# EAGLE design input-sequence (EAGLE 7.7.0)
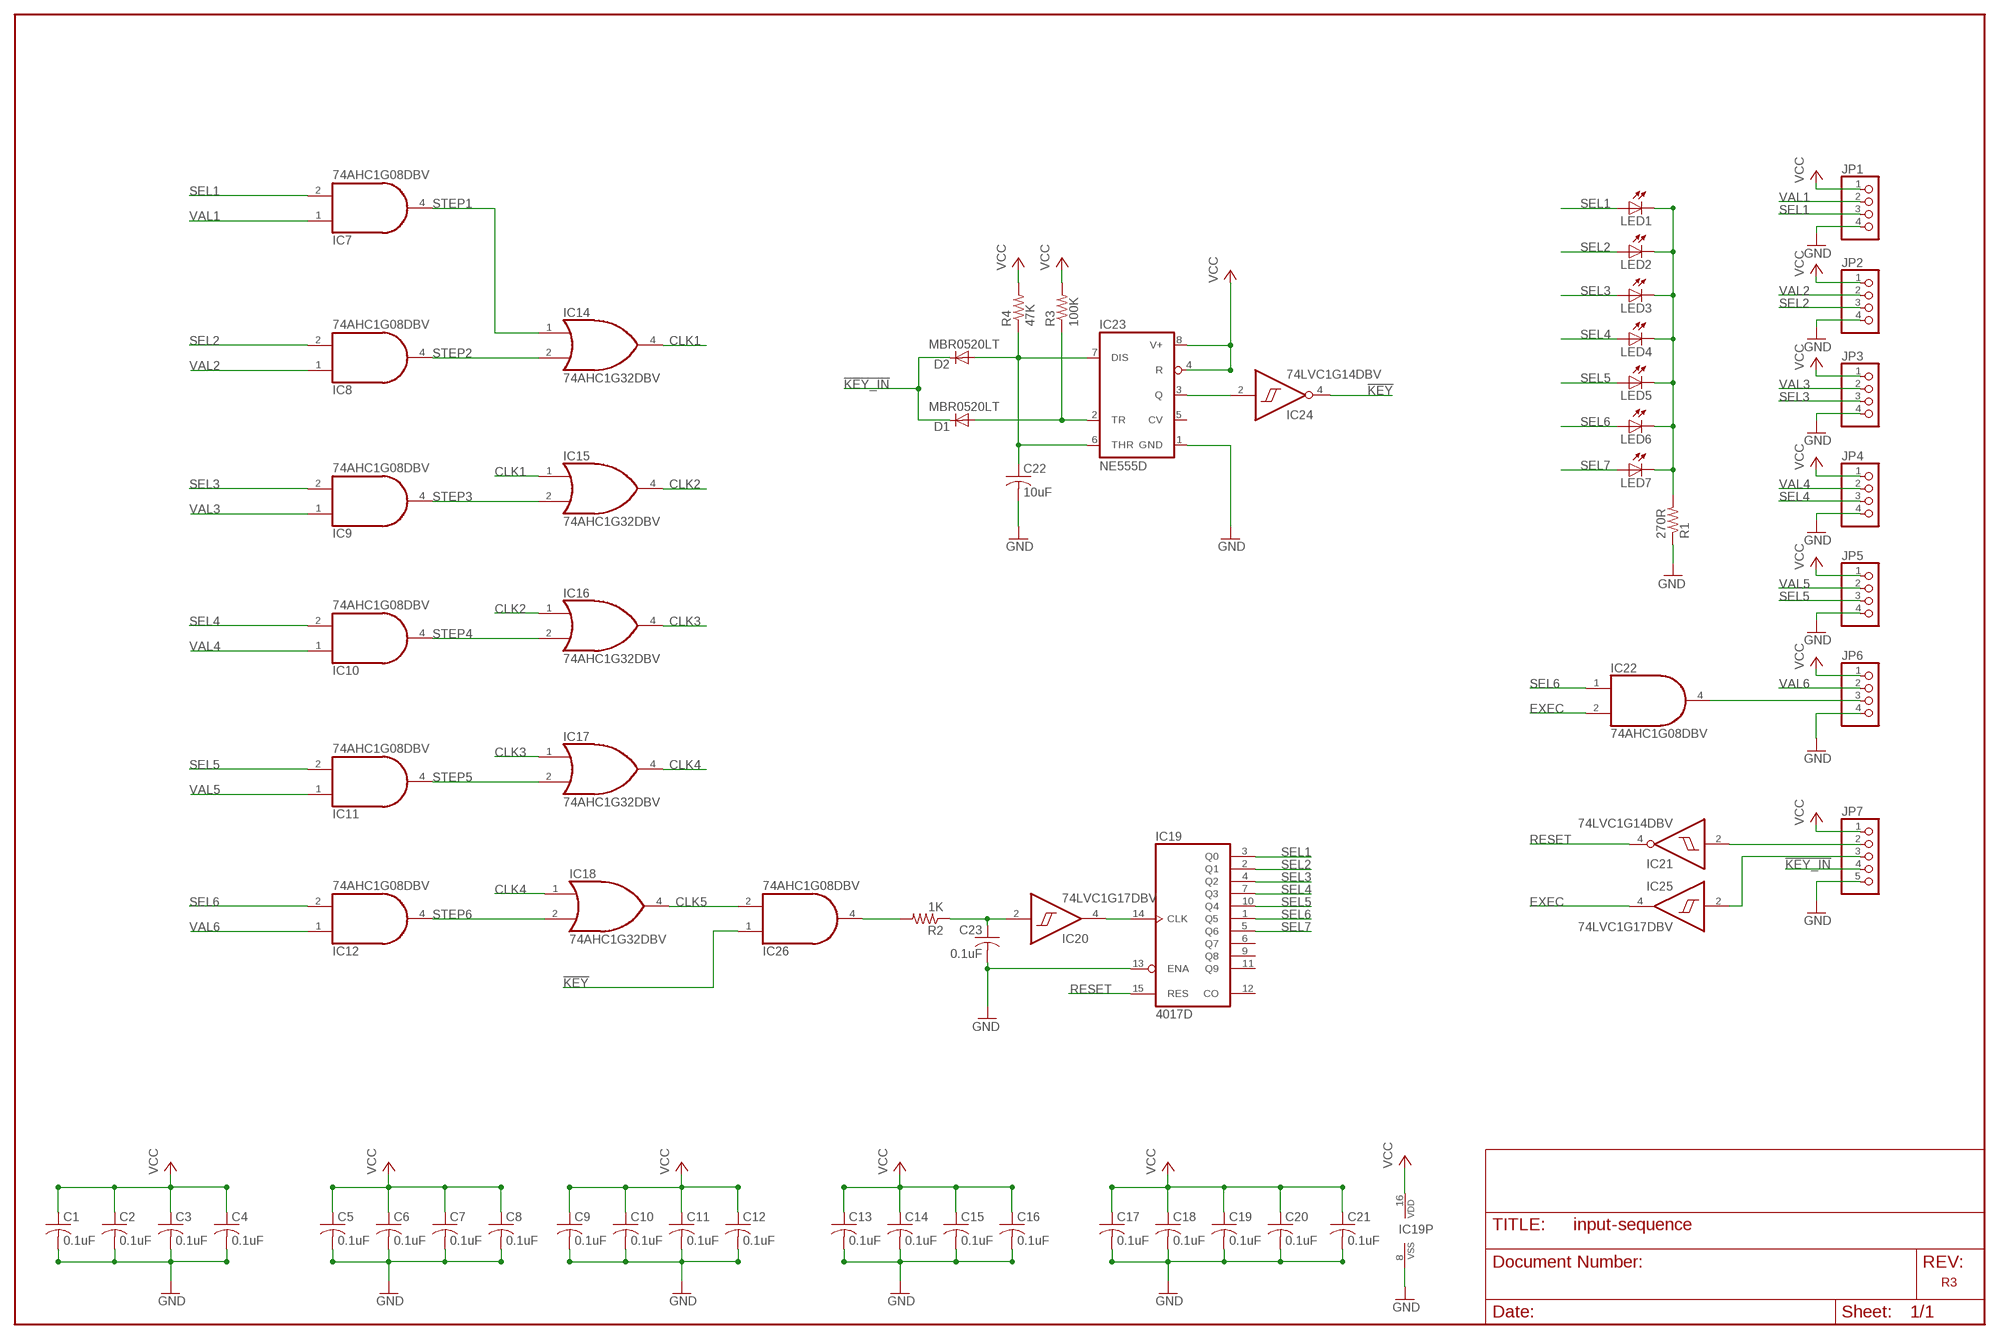
[diagram p0: schematic, sheet 1]

## Parts
C1  0.1uF  C-USC0603  [C0603]
C2  0.1uF  C-USC0603  [C0603]
C3  0.1uF  C-USC0603  [C0603]
C4  0.1uF  C-USC0603  [C0603]
C5  0.1uF  C-USC0603  [C0603]
C6  0.1uF  C-USC0603  [C0603]
C7  0.1uF  C-USC0603  [C0603]
C8  0.1uF  C-USC0603  [C0603]
C9  0.1uF  C-USC0603  [C0603]
C10  0.1uF  C-USC0603  [C0603]
C11  0.1uF  C-USC0603  [C0603]
C12  0.1uF  C-USC0603  [C0603]
C13  0.1uF  C-USC0603  [C0603]
C14  0.1uF  C-USC0603  [C0603]
C15  0.1uF  C-USC0603  [C0603]
C16  0.1uF  C-USC0603  [C0603]
C17  0.1uF  C-USC0603  [C0603]
C18  0.1uF  C-USC0603  [C0603]
C19  0.1uF  C-USC0603  [C0603]
C20  0.1uF  C-USC0603  [C0603]
C21  0.1uF  C-USC0603  [C0603]
C22  10uF  C-USC0805  [C0805]
C23  0.1uF  C-USC0603  [C0603]
D1  MBR0520LT  [SOD123]
D2  MBR0520LT  [SOD123]
IC7  74AHC1G08DBV  [SOT23-5]
IC8  74AHC1G08DBV  [SOT23-5]
IC9  74AHC1G08DBV  [SOT23-5]
IC10  74AHC1G08DBV  [SOT23-5]
IC11  74AHC1G08DBV  [SOT23-5]
IC12  74AHC1G08DBV  [SOT23-5]
IC14  74AHC1G32DBV  [SOT23-5]
IC15  74AHC1G32DBV  [SOT23-5]
IC16  74AHC1G32DBV  [SOT23-5]
IC17  74AHC1G32DBV  [SOT23-5]
IC18  74AHC1G32DBV  [SOT23-5]
IC19  4017D  [SO16]
IC20  74LVC1G17DBV  [SOT23-5]
IC21  74LVC1G14DBV  [SOT23-5]
IC22  74AHC1G08DBV  [SOT23-5]
IC23  NE555D  [SO08]
IC24  74LVC1G14DBV  [SOT23-5]
IC25  74LVC1G17DBV  [SOT23-5]
IC26  74AHC1G08DBV  [SOT23-5]
JP1  PINHD-1X4  [1X04]
JP2  PINHD-1X4  [1X04]
JP3  PINHD-1X4  [1X04]
JP4  PINHD-1X4  [1X04]
JP5  PINHD-1X4  [1X04]
JP6  PINHD-1X4  [1X04]
JP7  PINHD-1X5  [1X05]
LED1  RED  LEDCHIP-LED0805  [CHIP-LED0805]
LED2  RED  LEDCHIP-LED0805  [CHIP-LED0805]
LED3  RED  LEDCHIP-LED0805  [CHIP-LED0805]
LED4  RED  LEDCHIP-LED0805  [CHIP-LED0805]
LED5  RED  LEDCHIP-LED0805  [CHIP-LED0805]
LED6  RED  LEDCHIP-LED0805  [CHIP-LED0805]
LED7  RED  LEDCHIP-LED0805  [CHIP-LED0805]
R1  270R  R-US_R0805  [R0805]
R2  1K  R-US_R0805  [R0805]
R3  100K  R-US_R0805  [R0805]
R4  47K  R-US_R0805  [R0805]

## Nets
!CLEAR: IC21.2(I) JP7.2
!KEY: IC24.4(O) IC26.1(I0)
!KEY_IN: D1.C D2.C JP7.4
CLK1: IC14.4(O) IC15.1(I0)
CLK2: IC15.4(O) IC16.1(I0)
CLK3: IC16.4(O) IC17.1(I0)
CLK4: IC17.4(O) IC18.1(I0)
CLK5: IC18.4(O) IC26.2(I1)
EXEC: IC22.2(I1) IC25.4(O)
GND: C1.2 C2.2 C3.2 C4.2 C5.2 C6.2 C7.2 C8.2 C9.2 C10.2 C11.2 C12.2 C13.2 C14.2 C15.2 C16.2 C17.2 C18.2 C19.2 C20.2 C21.2 C22.2 C23.2 IC19.8(VSS) IC19.13(ENA) IC23.1(GND) JP1.4 JP2.4 JP3.4 JP4.4 JP5.4 JP6.4 JP7.5 R1.1
LED_SINK: LED1.C LED2.C LED3.C LED4.C LED5.C LED6.C LED7.C R1.2
N$7: IC22.4(O) JP6.3
N$8: IC19.14(CLK) IC20.4(O)
N$9: C22.1 D2.A IC23.6(THR) IC23.7(DIS) R4.1
N$10: D1.A IC23.2(TR) R3.1
N$11: IC23.3(Q) IC24.2(I)
N$12: IC25.2(I) JP7.3
N$13: C23.1 IC20.2(I) R2.1
N$14: IC26.4(O) R2.2
RESET: IC19.15(RES) IC21.4(O)
SEL1: IC7.2(I1) IC19.3(Q0) JP1.3 LED1.A
SEL2: IC8.2(I1) IC19.2(Q1) JP2.3 LED2.A
SEL3: IC9.2(I1) IC19.4(Q2) JP3.3 LED3.A
SEL4: IC10.2(I1) IC19.7(Q3) JP4.3 LED4.A
SEL5: IC11.2(I1) IC19.10(Q4) JP5.3 LED5.A
SEL6: IC12.2(I1) IC19.1(Q5) IC22.1(I0) LED6.A
SEL7: IC19.5(Q6) LED7.A
STEP1: IC7.4(O) IC14.1(I0)
STEP2: IC8.4(O) IC14.2(I1)
STEP3: IC9.4(O) IC15.2(I1)
STEP4: IC10.4(O) IC16.2(I1)
STEP5: IC11.4(O) IC17.2(I1)
STEP6: IC12.4(O) IC18.2(I1)
VAL1: IC7.1(I0) JP1.2
VAL2: IC8.1(I0) JP2.2
VAL3: IC9.1(I0) JP3.2
VAL4: IC10.1(I0) JP4.2
VAL5: IC11.1(I0) JP5.2
VAL6: IC12.1(I0) JP6.2
VCC: C1.1 C2.1 C3.1 C4.1 C5.1 C6.1 C7.1 C8.1 C9.1 C10.1 C11.1 C12.1 C13.1 C14.1 C15.1 C16.1 C17.1 C18.1 C19.1 C20.1 C21.1 IC19.16(VDD) IC23.4(R) IC23.8(V+) JP1.1 JP2.1 JP3.1 JP4.1 JP5.1 JP6.1 JP7.1 R3.2 R4.2
Unconnected: IC19.6(Q7) IC19.9(Q8) IC19.11(Q9) IC19.12(CO) IC23.5(CV)

## Notes on the sheet
- R3

## Power pins joined to a net without a drawn wire
GND: IC7.3(GND) IC8.3(GND) IC9.3(GND) IC10.3(GND) IC11.3(GND) IC12.3(GND) IC14.3(GND) IC15.3(GND) IC16.3(GND) IC17.3(GND) IC18.3(GND) IC20.3(GND) IC21.3(GND) IC22.3(GND) IC24.3(GND) IC25.3(GND) IC26.3(GND)
VCC: IC7.5(VCC) IC8.5(VCC) IC9.5(VCC) IC10.5(VCC) IC11.5(VCC) IC12.5(VCC) IC14.5(VCC) IC15.5(VCC) IC16.5(VCC) IC17.5(VCC) IC18.5(VCC) IC20.5(VCC) IC21.5(VCC) IC22.5(VCC) IC24.5(VCC) IC25.5(VCC) IC26.5(VCC)

## Library data of the parts
C1-C23 = resistor:C-US: CAPACITOR, American symbol
D1 D2 = diode:MBR0520LT: SCHOTTKY BARRIER RECTIFIER Source: http://onsemi.com .. MBR0520LT1-D.pdf
IC7-IC12 IC22 IC26 = 74xx-little-us:74*1G08: 2-input AND gate
IC14-IC18 = 74xx-little-us:74*1G32: 2-input OR gate
IC19 = 40xx:4017: COUNTER/DIVIDER
IC20 IC25 = 74xx-little-us:74*1G17: Single Schmitt-Trigger Buffer
IC21 IC24 = 74xx-little-us:74*1G14: Single Schmitt-Trigger Inverter Gate
IC23 = adafruit:*555: TIMER Changed DIP package to have round (not oval) pin pads http://www.ladyada.net/library/pcb/eaglelibrary.html
JP1-JP6 = custom-pinhead:PINHD-1X4: PIN HEADER
JP7 = custom-pinhead:PINHD-1X5: PIN HEADER
LED1-LED7 = led:LED: LED OSRAM: - CHIPLED LG R971, LG N971, LY N971, LG Q971, LY Q971, LO R971, LY R971 LH N974, LH R974 LS Q976, LO Q976, LY Q976 LO Q996 - Hyper CHIPLED LW Q18S LB Q993, LB Q99A, LB R99A - SideLED LS A670, LO A670, LY A670, LG A670, LP A670 LB A673, LV A673, LT A673, LW A673 LH A674 LY A675 LS A676, LA A676, LO A676, LY A676, LW A676 LS A679, LY A679, LG A679 - Hyper Micro SIDELED® LS Y876, LA Y876, LO Y876, LY Y876 LT Y87S - SmartLED LW L88C, LW L88S LB L89C, LB L89S, LG L890 LS L89K, LO L89K, LY L89K LS L896, LA L896, LO L896, LY L896 - TOPLED LS T670, LO T670, LY T670, LG T670, LP T670 LSG T670, LSP T670, LSY T670, LOP T670, LYG T670 LG T671, LOG T671, LSG T671 LB T673, LV T673, LT T673, LW T673 LH T674 LS T676, LA T676, LO T676, LY T676, LB T676, LH T676, LSB T676, LW T676 LB T67C, LV T67C, LT T67C, LS T67K, LO T67K, LY T67K, LW E67C LS E67B, LA E67B, LO E67B, LY E67B, LB E67C, LV E67C, LT E67C LW T67C LS T679, LY T679, LG T679 LS T770, LO T770, LY T770, LG T770, LP T770 LB T773, LV T773, LT T773, LW T773 LH T774 LS E675, LA E675, LY E675, LS T675 LS T776, LA T776, LO T776, LY T776, LB T776 LHGB T686 LT T68C, LB T68C - Hyper Mini TOPLED® LB M676 - Mini TOPLED Santana® LG M470 LS M47K, LO M47K, LY M47K Source: http://www.osram.convergy.de LUXEON: - LUMILED® LXK2-PW12-R00, LXK2-PW12-S00, LXK2-PW14-U00, LXK2-PW14-V00 LXK2-PM12-R00, LXK2-PM12-S00, LXK2-PM14-U00 LXK2-PE12-Q00, LXK2-PE12-R00, LXK2-PE12-S00, LXK2-PE14-T00, LXK2-PE14-U00 LXK2-PB12-K00, LXK2-PB12-L00, LXK2-PB12-M00, LXK2-PB14-N00, LXK2-PB14-P00, LXK2-PB14-Q00 LXK2-PR12-L00, LXK2-PR12-M00, LXK2-PR14-Q00, LXK2-PR14-R00 LXK2-PD12-Q00, LXK2-PD12-R00, LXK2-PD12-S00 LXK2-PH12-R00, LXK2-PH12-S00 LXK2-PL12-P00, LXK2-PL12-Q00, LXK2-PL12-R00 Source: www.luxeon.com KINGBRIGHT: KA-3528ASYC Source: www.kingbright.com
R1-R4 = resistor:R-US_: RESISTOR, American symbol

## Board
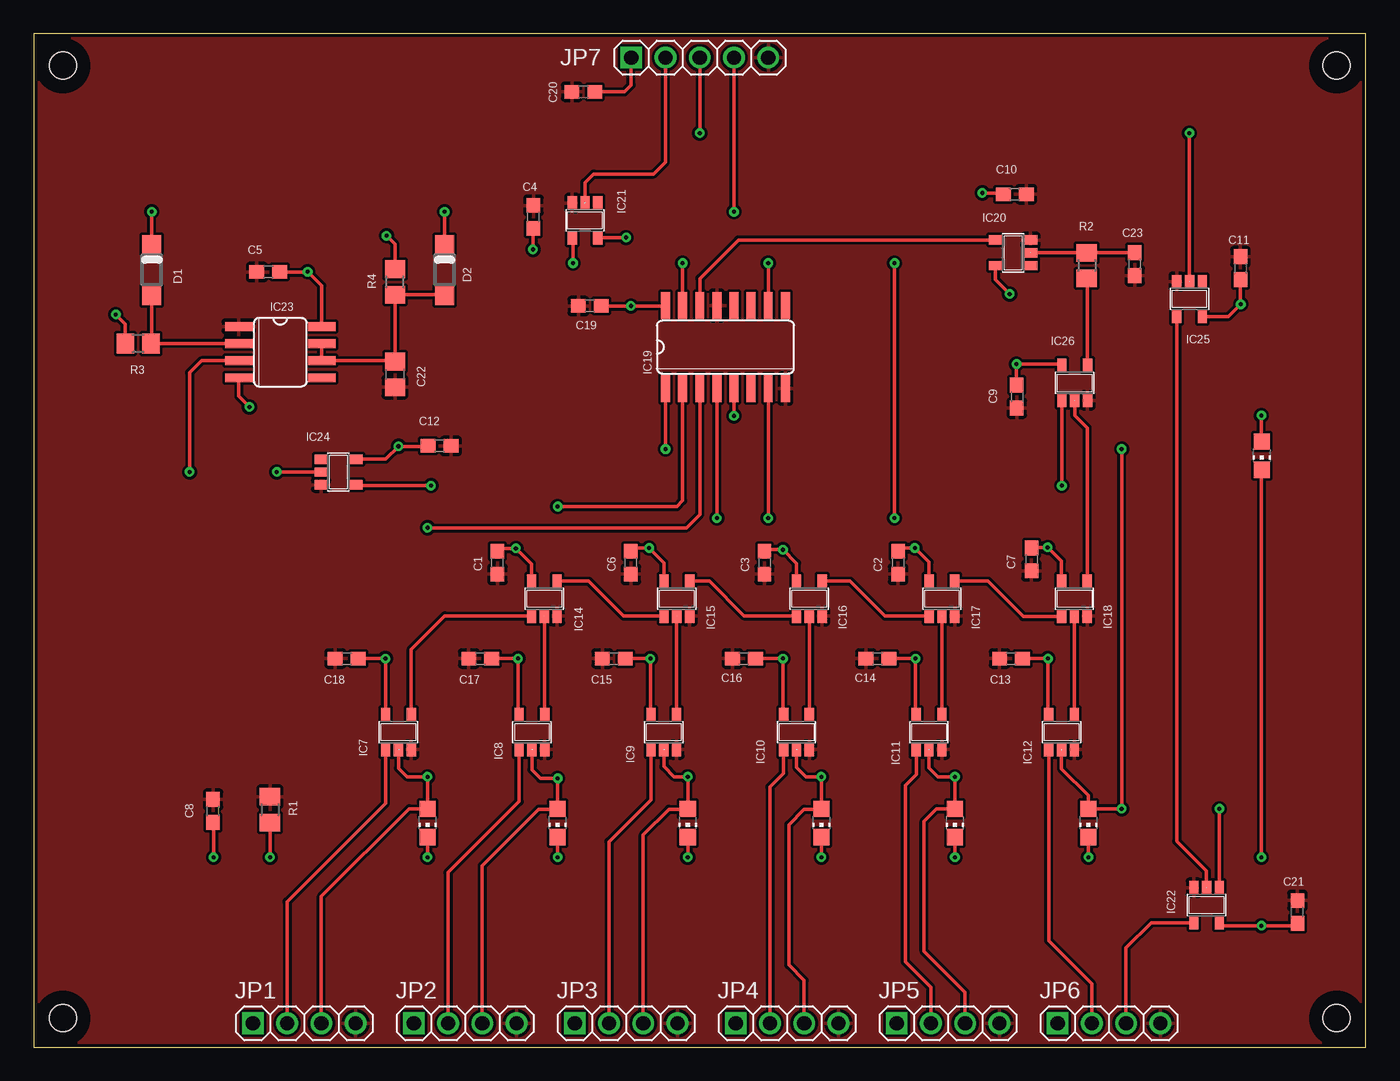
[diagram p1: board, top side]
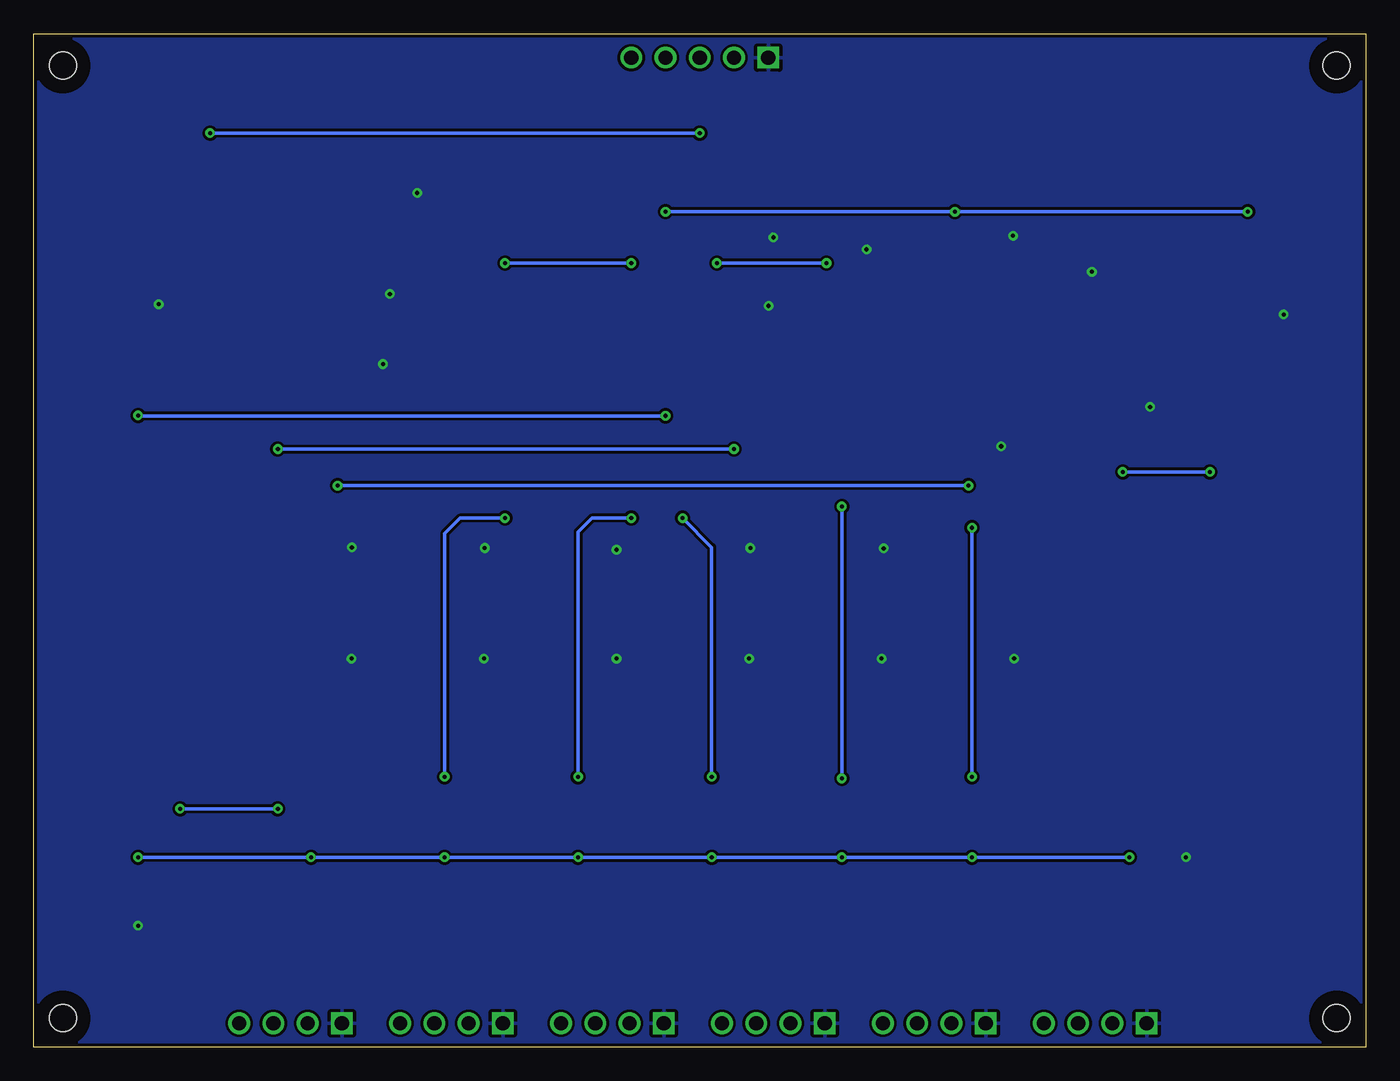
[diagram p2: board, bottom side, seen from below]

Size 98.81 x 75.18 mm. Coordinates in mm from the lower left corner, seen from the top.
Outline: 0,0 98.81,0 98.81,75.18 0,75.18 0,0
Copper layers (1*16): Top 0.035mm / dielectric 1.5mm / Bottom 0.035mm
Design rules "default *": minimum track width 10mil, minimum drill 12mil, track to track 8mil, track to pad 8mil, pad to pad 8mil, via to via 8mil, smd to smd 8mil, copper to edge 10mil, drill to drill 8mil, minimum pad ring 10mil, minimum via ring 8mil, stop-mask expansion 4mil, vias tented up to drill 0mil, thermal gap 10mil
Holes 2.01 mm at 2.16,2.16 96.65,2.16 2.16,72.82 96.65,72.82
tRestrict: area 0.2,0.2 to 4.2,4.2; area 94.6,0.2 to 98.7,4.2; area 0.2,70.8 to 4.2,74.8; area 94.6,70.8 to 98.7,74.8
bRestrict: area 0.2,0.2 to 4.2,4.2; area 94.6,0.2 to 98.7,4.2; area 0.2,70.8 to 4.2,74.8; area 94.6,70.8 to 98.7,74.8

### Footprints (pad centres in the part's own frame; a part is rotated, then mirrored left to right if it is on the bottom)
C0603 = smd 1.1 x 1: 1 -0.85,0; 2 0.85,0
C0805 = smd 1.3 x 1.5: 1 -0.95,0; 2 0.95,0
SOD123 = smd 1.4 x 1.4: A 1.9,0; C -1.9,0
SOT23-5 = smd 0.69 x 0.99: 1 -0.95,-1.29; 2 0,-1.29; 3 0.95,-1.29; 4 0.95,1.3; 5 -0.95,1.3
SO16 = smd 0.66 x 2.032: 1 -4.445,-3.073; 2 -3.175,-3.073; 3 -1.905,-3.073; 4 -0.635,-3.073; 5 0.635,-3.073; 6 1.905,-3.073; 7 3.175,-3.073; 8 4.445,-3.073; 9 4.445,3.073; 10 3.175,3.073; 11 1.905,3.073; 12 0.635,3.073; 13 -0.635,3.073; 14 -1.905,3.073; 15 -3.175,3.073; 16 -4.445,3.073
SO08 = smd 0.66 x 2.032: 1 -1.905,-3.073; 2 -0.635,-3.073; 3 0.635,-3.073; 4 1.905,-3.073; 5 1.905,3.073; 6 0.635,3.073; 7 -0.635,3.073; 8 -1.905,3.073
1X04 = drill 1.067 square: 1 -3.81,0 | drill 1.067: 2 -1.27,0; 3 1.27,0; 4 3.81,0
1X05 = drill 1.067 square: 1 -5.08,0 | drill 1.067: 2 -2.54,0; 3 0,0; 4 2.54,0; 5 5.08,0
CHIP-LED0805 = smd 1.2 x 1.2: A 0,-1.05; C 0,1.05
R0805 = smd 1.3 x 1.5: 1 -0.95,0; 2 0.95,0

### Placement (x,y rotation side)
C1  34.39,35.94 270 top
C2  64.11,35.94 270 top
C3  54.2,35.94 270 top
C4  37.06,61.59 90 top
C5  17.4,57.51 180 top
C6  44.3,35.94 270 top
C7  74.02,36.2 270 top
C8  13.31,17.53 90 top
C9  72.92,48.26 270 top
C10  72.77,63.27 0 top
C11  89.51,57.78 90 top
C12  30.1,44.6 0 top
C13  72.49,28.83 180 top
C14  62.59,28.83 180 top
C15  43.03,28.83 180 top
C16  52.68,28.83 180 top
C17  33.12,28.83 180 top
C18  23.22,28.83 180 top
C19  41.25,54.99 180 top
C20  40.77,70.87 180 top
C21  93.73,10.03 90 top
C22  26.8,49.91 270 top
C23  81.66,58.09 270 top
D1  8.76,57.66 270 top
D2  30.48,57.66 270 top
IC7  27.05,23.37 0 top
IC8  36.96,23.37 0 top
IC9  46.74,23.37 0 top
IC10  56.58,23.37 0 top
IC11  66.41,23.37 0 top
IC12  76.24,23.37 0 top
IC14  37.87,33.27 0 top
IC15  47.7,33.27 0 top
IC16  57.53,33.27 0 top
IC17  67.36,33.27 0 top
IC18  77.19,33.27 0 top
IC19  51.31,51.94 0 top
IC20  72.64,58.93 90 top
IC21  40.89,61.34 180 top
IC22  87,10.54 180 top
IC23  18.29,51.56 270 top
IC24  22.61,42.67 270 top
IC25  85.72,55.5 180 top
IC26  77.22,49.28 0 top
JP1  20.07,1.78 0 top
JP2  32,1.78 0 top
JP3  43.94,1.78 0 top
JP4  55.88,1.78 0 top
JP5  67.82,1.78 0 top
JP6  79.76,1.78 0 top
JP7  49.4,73.41 0 top
LED1  29.21,16.64 180 top
LED2  38.86,16.64 180 top
LED3  48.51,16.64 180 top
LED4  58.42,16.64 180 top
LED5  68.33,16.64 180 top
LED6  78.23,16.64 180 top
LED7  91.08,43.89 180 top
R1  17.53,17.63 270 top
R2  78.11,57.99 270 top
R3  7.75,52.2 180 top
R4  26.8,56.77 90 top

### Tracks (layer width: path | path; a pad name or v marks a point on that pad's centre or on a via)
!CLEAR
  Top 0.254: IC21.2 40.89,64.14 41.53,64.77 45.97,64.77 46.86,65.66 JP7.2
!KEY  (via drill 0.3)
  Top 0.254: IC24.4 23.97,41.66 v29.46,41.66 | v76.27,41.66 IC26.1
  Bottom 0.254: v29.46,41.66 v76.27,41.66
!KEY_IN  (via drill 0.3)
  Top 0.254: D1.C v8.76,61.98 | v30.48,61.98 D2.C | v51.94,61.98 JP7.4
  Bottom 0.254: v8.76,61.98 v30.48,61.98 v51.94,61.98
CLK1
  Top 0.254: IC14.4 41.17,34.57 43.76,31.98 IC15.1
CLK2
  Top 0.254: IC15.4 50.11,34.57 52.68,32 56.56,32 IC16.1
CLK3
  Top 0.254: IC16.4 60.55,34.57 63.14,31.98 IC17.1
CLK4
  Top 0.254: IC17.4 70.78,34.57 73.41,31.95 76.21,31.95 IC18.1
CLK5
  Top 0.254: IC18.4 78.14,45.94 77.22,46.86 IC26.2
EXEC
  Top 0.254: IC22.2 87,13.08 84.9,15.18 84.84,15.24 84.78,15.3 IC25.4
GND
  pour Top: 0,0 98.81,0 98.81,75.18 0,75.18
LED_SINK  (via drill 0.3)
  Top 0.254: LED1.C v29.21,14.1 | v38.86,14.1 LED2.C | LED3.C v48.51,14.1 | LED4.C v58.42,14.1 | LED5.C v68.33,14.1 | LED6.C v78.23,14.1 | v17.53,14.1 R1.2 | LED7.C 91.06,42.84 v91.06,14.1
  Bottom 0.254: v17.53,14.1 v29.21,14.1 v38.86,14.1 v48.51,14.1 v58.42,14.1 v68.33,14.1 v78.23,14.1 v91.06,14.1
N$7
  Top 0.254: IC22.4 82.9,9.24 81.03,7.37 JP6.3
N$8
  Top 0.254: IC20.4 52.26,59.88 49.4,57.02 IC19.14
N$9
  Top 0.254: IC23.7 IC23.6 26.73,50.93 C22.1 R4.1 30.42,55.82 D2.A
N$10
  Top 0.254: IC23.2 R3.1 8.76,52.26 D1.A
N$11  (via drill 0.3)
  Top 0.254: IC23.3 12.45,50.93 11.56,50.04 v11.56,42.67 | v18.03,42.67 IC24.2
  Bottom 0.254: v11.56,42.67 v18.03,42.67
N$12  (via drill 0.3)
  Top 0.254: JP7.3 v49.4,67.82 | v85.72,67.82 IC25.2
  Bottom 0.254: v49.4,67.82 v85.72,67.82
N$13
  Top 0.254: IC20.2 78.09,58.93 R2.1 C23.1
N$14
  Top 0.254: IC26.4 78.17,56.98 R2.2
RESET  (via drill 0.3)
  Top 0.254: 39.81,59.91 IC21.4 40.01,59.98 v40.01,58.17 | v48.13,58.17 IC19.15
  Bottom 0.254: v40.01,58.17 v48.13,58.17
SEL1  (via drill 0.3)
  Top 0.254: v29.21,38.53 48.41,38.53 49.4,39.52 IC19.3 | IC7.2 27.05,20.7 27.69,20.07 v29.21,20.07 LED1.A 27.85,17.69 21.34,11.18 JP1.3
  Bottom 0.254: v29.21,38.53 v29.21,20.07
SEL2  (via drill 0.3)
  Top 0.254: v38.86,40.11 47.7,40.11 48.13,40.54 IC19.2 | IC8.2 36.96,20.57 37.59,19.94 v38.86,19.94 LED2.A 38.83,17.65 37.47,17.65 33.27,13.46 JP2.3
  Bottom 0.254: v38.86,40.11 v38.86,19.94
SEL3  (via drill 0.3)
  Top 0.254: v50.67,39.24 IC19.4 | IC9.2 46.74,20.83 47.5,20.07 v48.51,20.07 LED3.A 48.48,17.65 47.12,17.65 45.21,15.75 JP3.3
  Bottom 0.254: v50.67,39.24 48.51,37.08 v48.51,20.07
SEL4  (via drill 0.3)
  Top 0.254: v54.48,39.24 IC19.7 | IC10.2 56.58,20.77 57.28,20.07 v58.42,20.07 LED4.A 58.39,17.65 57.15,17.65 56.01,16.51 56.01,6.1 57.15,4.95 JP4.3
  Bottom 0.254: v54.48,39.24 57.4,39.24 58.42,38.23 v58.42,20.07
SEL5  (via drill 0.3)
  Top 0.254: IC11.2 66.41,20.71 67.06,20.07 v68.33,20.07 LED5.A | 68.36,17.65 LED5.A | IC19.10 v54.48,58.17 | v63.86,58.17 v63.86,39.24 | 68.29,17.65 LED5.A | JP5.3 69.09,4.06 66.04,7.11 66.04,16.76 66.96,17.69 LED5.A
  Bottom 0.254: v54.48,58.17 v63.86,58.17 | v63.86,39.24 67.18,39.24 68.33,38.1 v68.33,20.07
SEL6  (via drill 0.3)
  Top 0.254: v80.7,44.37 v80.7,17.69 LED6.A 78.23,18.67 76.24,20.66 IC12.2 | v46.86,44.37 IC19.1 | IC22.1 v87.94,17.69
  Bottom 0.254: v80.7,44.37 v46.86,44.37 | v80.7,17.69 v87.94,17.69
SEL7  (via drill 0.3)
  Top 0.254: v51.94,46.84 IC19.5 | LED7.A 91.06,44.94 v91.06,46.86
  Bottom 0.254: 51.89,46.89 arc90 v51.94,46.84 91.03,46.84 v91.06,46.86
STEP1
  Top 0.254: IC7.4 28,29.52 30.48,32 36.9,32 IC14.1
STEP2
  Top 0.254: IC14.2 37.91,31.95 IC8.4
STEP3
  Top 0.254: IC15.2 47.69,31.97 IC9.4
STEP4
  Top 0.254: IC16.2 IC10.4
STEP5
  Top 0.254: IC17.2 IC11.4
STEP6
  Top 0.254: IC18.2 IC12.4
VAL1
  Top 0.254: JP1.2 18.8,10.79 26.1,18.1 IC7.1
VAL2
  Top 0.254: JP2.2 30.73,12.95 36.01,18.23 IC8.1
VAL3
  Top 0.254: JP3.2 42.67,15.24 45.79,18.35 IC9.1
VAL4
  Top 0.254: JP4.2 54.61,19.3 55.63,20.32 IC10.1
VAL5
  Top 0.254: JP5.2 66.55,4.45 64.64,6.35 64.64,19.43 65.46,20.25 IC11.1
VAL6
  Top 0.254: JP6.2 78.49,4.7 75.29,7.9 IC12.1
VCC  (via drill 0.3)
  Top 0.254: IC14.5 36.92,35.85 v35.76,37.01 34.61,37.01 C1.1 | IC15.5 46.75,35.93 v45.64,37.03 44.54,37.03 C6.1 | IC16.5 56.58,35.9 v55.58,36.91 54.32,36.91 C3.1 | IC17.5 66.41,35.98 v65.35,37.03 64.35,37.03 C2.1 | IC18.5 76.24,36.05 v75.21,37.08 74.06,37.08 C7.1 | C4.1 37.03,60.72 v37.03,59.18 | C10.1 71.82,63.37 v70.36,63.37 | C14.1 v65.41,28.83 65.41,24.72 IC11.5 | C13.1 v75.23,28.83 75.23,24.72 IC12.5 | C16.1 v55.58,28.83 55.58,24.72 IC10.5 | C15.1 v45.74,28.83 45.74,24.71 IC9.5 | C17.1 v35.92,28.83 35.92,24.76 IC8.5 | C18.1 v26.09,28.83 26.09,24.68 IC7.5 | C19.1 v44.3,54.99 46.84,54.99 IC19.16 | IC21.5 41.87,60.07 v43.94,60.07 | IC22.5 88.17,9.02 v91.06,9.02 93.56,9.02 C21.1 | IC20.5 71.34,56.93 v72.39,55.88 | C20.1 43.81,70.87 44.32,71.37 JP7.1 | R3.2 6.8,53.66 v6.1,54.36 | IC23.4 15.21,48.28 v16,47.5 | R4.2 26.8,59.56 v26.16,60.2 | IC23.8 21.36,56.49 v20.32,57.53 20.3,57.51 C5.1 | IC25.5 88.62,54.2 v89.53,55.12 89.51,55.14 C11.1 | IC24.5 26.1,43.62 v27.05,44.58 29.22,44.58 C12.1 | IC26.5 76.17,50.67 v72.9,50.67 72.9,49.13 C9.1 | C8.1 arc-90 13.34,16.65 v13.34,14.1
  pour Bottom: 0,0 98.81,0 98.81,75.18 0,75.18

### Text on the board
Document: Input Sequencer | Revison 3 | DONE | 1 | 2 | 3 | 4 | 5 | EXE